# Altium schematic sheet P11_RS2-32_RS-485.SchDoc
size 420 x 297 mm
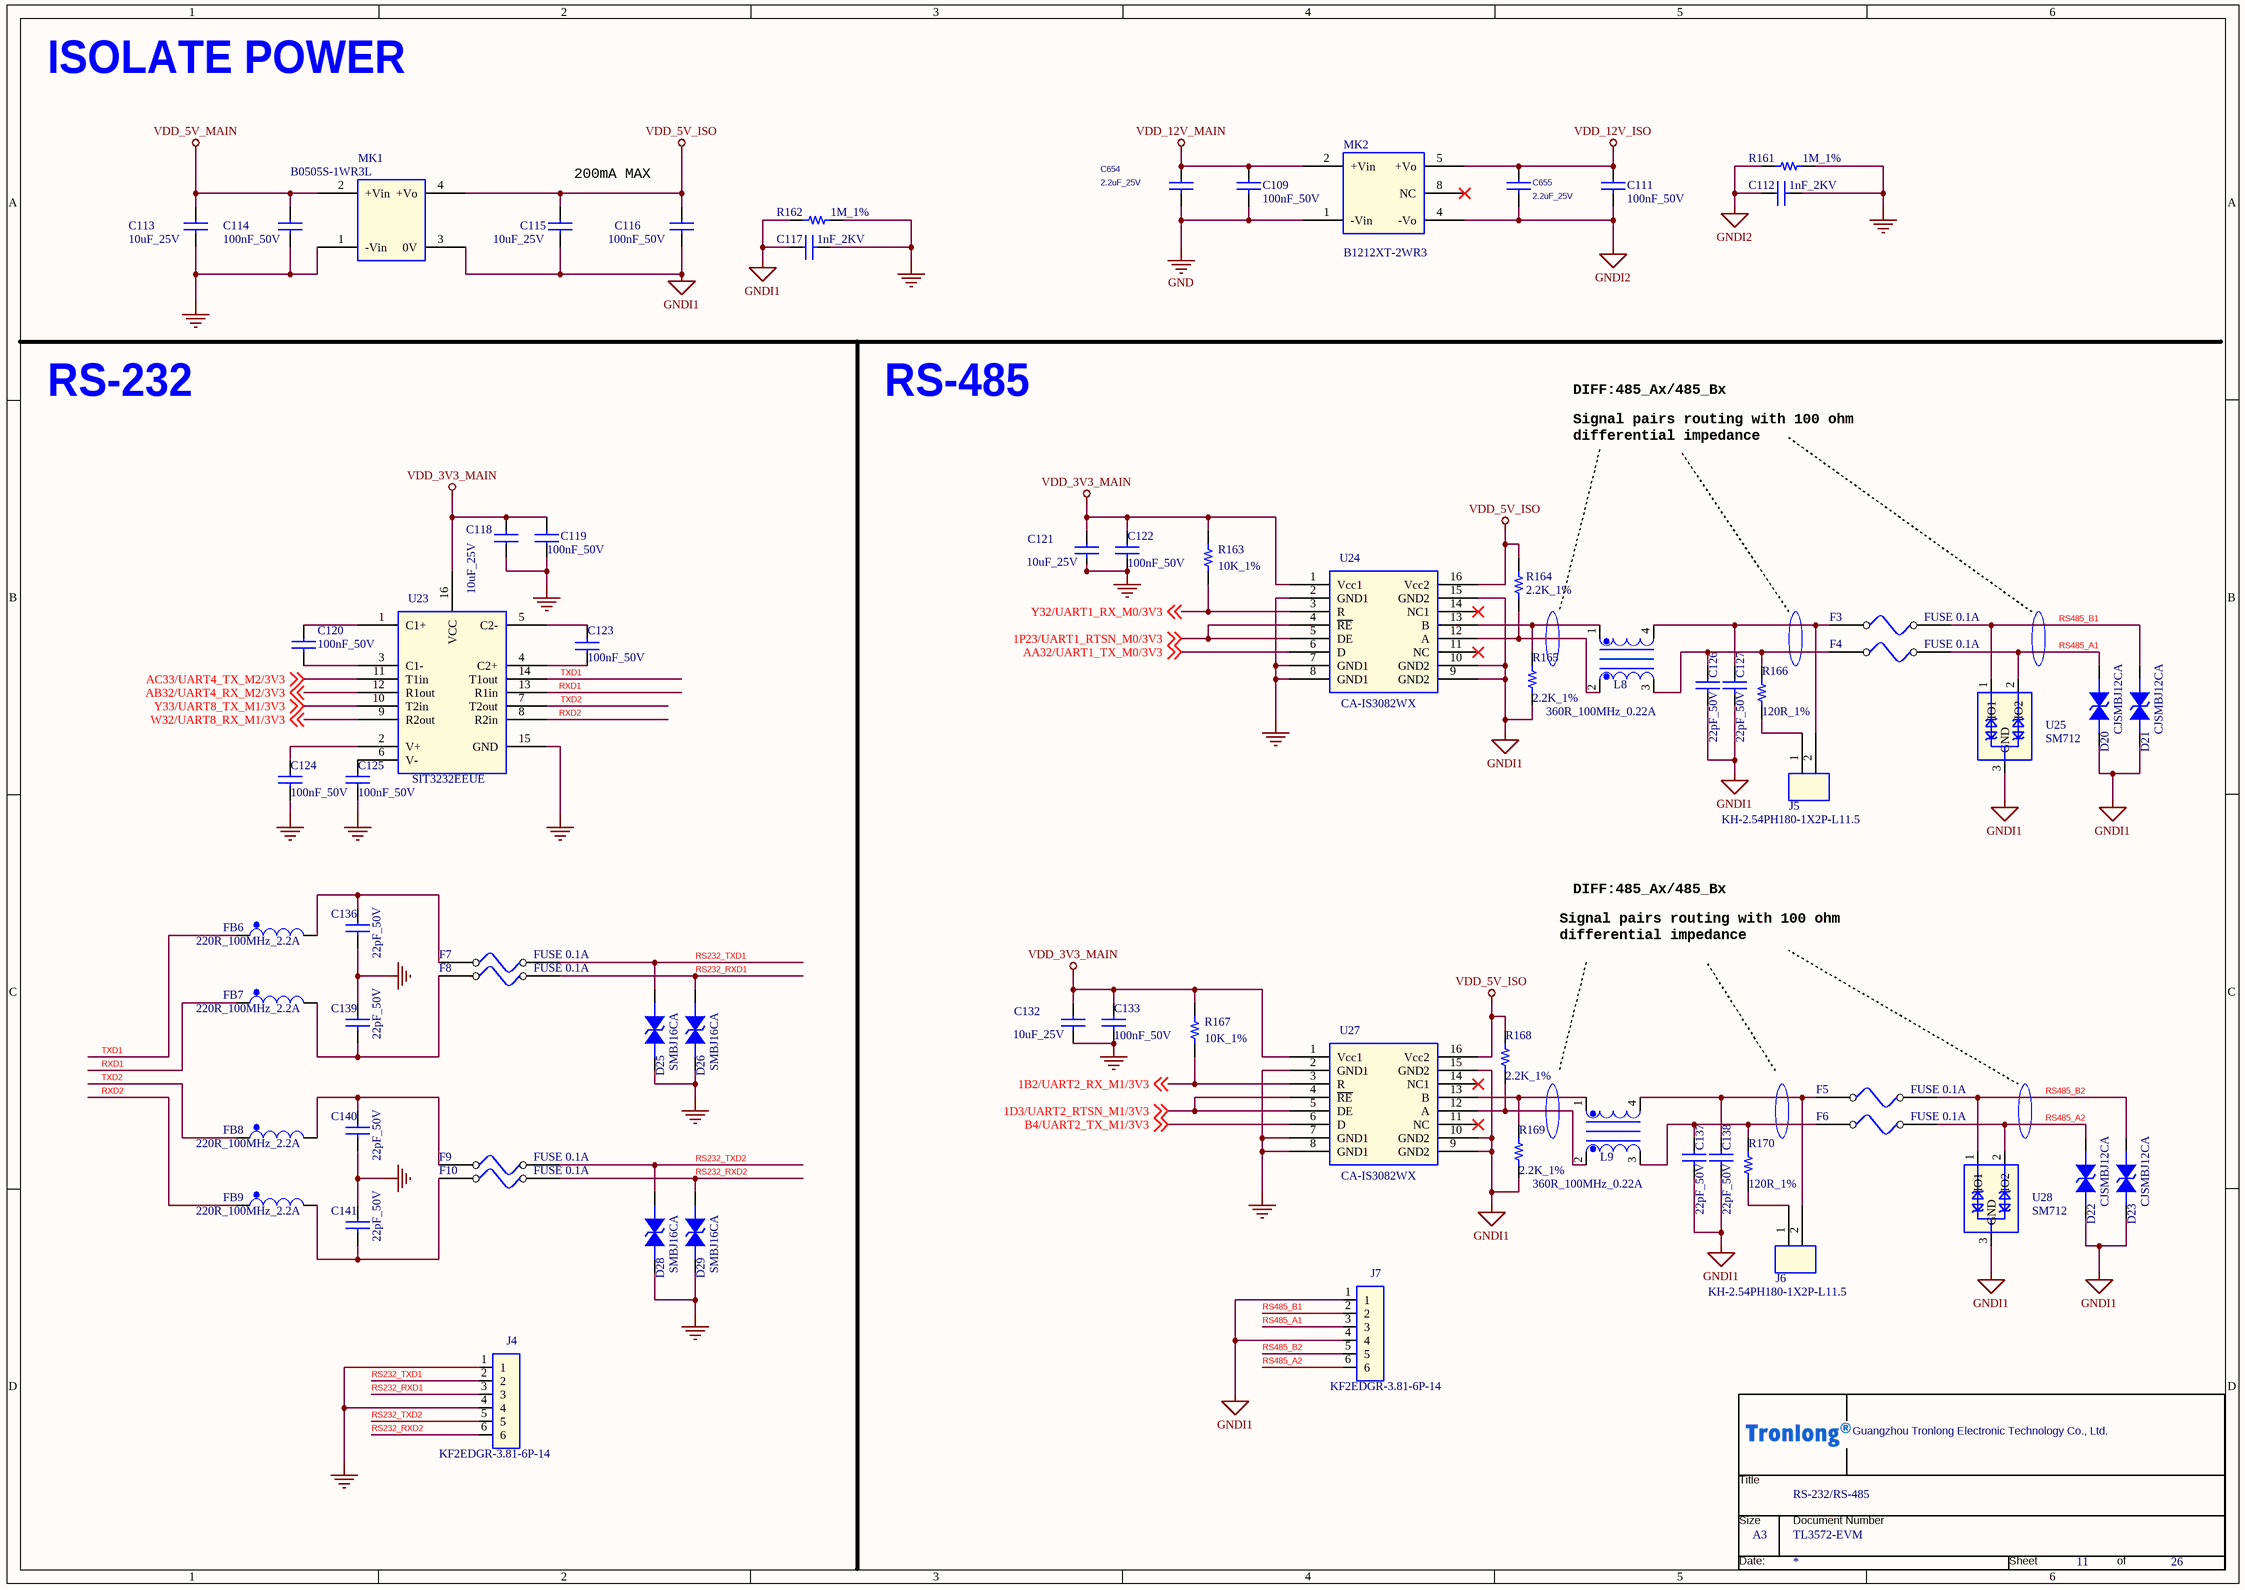
[diagram p0: P11_RS2-32_RS-485.SchDoc]

## Parts
*  Doc: TL3572-EVM  Title: RS-232/RS-485  OrgName: Guangzhou Tronlong Electronic Technology Co., Ltd.  Page Size: A3  Page Number: 11  Page Count: 26  (hidden comment: Tronlong_TITTLE_20211115)  (graphical)
C109  100nF_50V  [C0402]
C111  100nF_50V  [C0402]
C112  1nF_2KV  [C1206]
C113  10uF_25V  [C0603]
C114  100nF_50V  [C0402]
C115  10uF_25V  [C0603]
C116  100nF_50V  [C0402]
C117  1nF_2KV  [C1206]
C118  10uF_25V  [C0603]
C119  100nF_50V  [C0402]
C120  100nF_50V  [C0402]
C121  10uF_25V  [C0603]
C122  100nF_50V  [C0402]
C123  100nF_50V  [C0402]
C124  100nF_50V  [C0402]
C125  100nF_50V  [C0402]
C126  22pF_50V  [C0603]
C127  22pF_50V  [C0603]
C132  10uF_25V  [C0603]
C133  100nF_50V  [C0402]
C136  22pF_50V  [C0603]
C137  22pF_50V  [C0603]
C138  22pF_50V  [C0603]
C139  22pF_50V  [C0603]
C140  22pF_50V  [C0603]
C141  22pF_50V  [C0603]
C654  2.2uF_25V  [C1206]
C655  2.2uF_25V  [C1206]
D20  CJSMBJ12CA  [SMB]
D21  CJSMBJ12CA  [SMB]
D22  CJSMBJ12CA  [SMB]
D23  CJSMBJ12CA  [SMB]
D25  SMBJ16CA  [SMB]
D26  SMBJ16CA  [SMB]
D28  SMBJ16CA  [SMB]
D29  SMBJ16CA  [SMB]
F3  FUSE 0.1A  [F0805]
F4  FUSE 0.1A  [F0805]
F5  FUSE 0.1A  [F0805]
F6  FUSE 0.1A  [F0805]
F7  FUSE 0.1A  [F0805]
F8  FUSE 0.1A  [F0805]
F9  FUSE 0.1A  [F0805]
F10  FUSE 0.1A  [F0805]
FB6  220R_100MHz_2.2A  [L0603]
FB7  220R_100MHz_2.2A  [L0603]
FB8  220R_100MHz_2.2A  [L0603]
FB9  220R_100MHz_2.2A  [L0603]
J4  KF2EDGR-3.81-6P-14  [kf2eg_3_81-6p]
J5  KH-2.54PH180-1X2P-L11.5  [header_1x2p_2d54_male]
J6  KH-2.54PH180-1X2P-L11.5  [header_1x2p_2d54_male]
J7  KF2EDGR-3.81-6P-14  [kf2eg_3_81-6p]
L8  360R_100MHz_0.22A  [SMD-L2012M-4P]
L9  360R_100MHz_0.22A  [SMD-L2012M-4P]
MK1  B0505S-1WR3L  [PW_4P_2D54_L116W60_180_DIP]
MK2  B1212XT-2WR3  [PWRM_SMD_5P_L132W85_P254_LS114]
R161  1M_1%  [R1206]
R162  1M_1%  [R1206]
R163  10K_1%  [R0402]
R164  2.2K_1%  [R0603]
R165  2.2K_1%  [R0603]
R166  120R_1%  [R0805]
R167  10K_1%  [R0402]
R168  2.2K_1%  [R0603]
R169  2.2K_1%  [R0603]
R170  120R_1%  [R0805]
U23  SIT3232EEUE  [TSSOP16_PW16]
U24  CA-IS3082WX  [SO16W]
U25  SM712  [SOT23-3]
U27  CA-IS3082WX  [SO16W]
U28  SM712  [SOT23-3]

## Nets
GND: C109.2 C112.2 C113.2 C114.2 C117.2 C118.1 C119.1 C121.2 C122.2 C124.2 C125.2 C132.2 C133.2 C136.2 C139.1 C140.2 C141.1 C654.2 D25.1 D26.1 D28.1 D29.1 J4.1 J4.4 MK1.1(-Vin) MK2.1(-Vin) R161.2 R162.2 U23.15(GND) U24.2(GND1) U24.7(GND1) U24.8(GND1) U27.2(GND1) U27.7(GND1) U27.8(GND1)
GNDI1: C115.2 C116.2 C117.1 C126.2 C127.2 C137.2 C138.2 D20.1 D21.1 D22.1 D23.1 J7.1 J7.4 MK1.3(0V) R162.1 R165.2 R169.2 U24.9(GND2) U24.10(GND2) U24.15(GND2) U25.3(GND) U27.9(GND2) U27.10(GND2) U27.15(GND2) U28.3(GND)
GNDI2: C111.2 C112.1 C655.2 MK2.4(-Vo) R161.1
VDD_3V3_MAIN: C118.2 C119.2 C121.1 C122.1 C132.1 C133.1 R163.1 R167.1 U23.16(VCC) U24.1(Vcc1) U27.1(Vcc1)
VDD_5V_ISO: C115.1 C116.1 MK1.4(+Vo) R164.1 R168.1 U24.16(Vcc2) U27.16(Vcc2)
VDD_5V_MAIN: C113.1 C114.1 MK1.2(+Vin)
VDD_12V_ISO: C111.1 C655.1 MK2.5(+Vo)
VDD_12V_MAIN: C109.1 C654.1 MK2.2(+Vin)
1B2/UART2_RX_M1/3V3: R167.2 U27.3(R) ; off-sheet 1B2/UART2_RX_M1/3V3
1D3/UART2_RTSN_M1/3V3: U27.4(~{RE}) U27.5(DE) ; off-sheet 1D3/UART2_RTSN_M1/3V3
1P23/UART1_RTSN_M0/3V3: U24.4(~{RE}) U24.5(DE) ; off-sheet 1P23/UART1_RTSN_M0/3V3
AA32/UART1_TX_M0/3V3: U24.6(D) ; off-sheet AA32/UART1_TX_M0/3V3
AB32/UART4_RX_M2/3V3: U23.12(R1out) ; off-sheet AB32/UART4_RX_M2/3V3
AC33/UART4_TX_M2/3V3: U23.11(T1in) ; off-sheet AC33/UART4_TX_M2/3V3
B4/UART2_TX_M1/3V3: U27.6(D) ; off-sheet B4/UART2_TX_M1/3V3
RS232_RXD1: D26.2 F8.2 J4.3
RS232_RXD2: D29.2 F10.2 J4.6
RS232_TXD1: D25.2 F7.2 J4.2
RS232_TXD2: D28.2 F9.2 J4.5
RS485_A1: D20.2 F4.2 J7.3 U25.2(IO2)
RS485_A2: D22.2 F6.2 J7.6 U28.2(IO2)
RS485_B1: D21.2 F3.2 J7.2 U25.1(IO1)
RS485_B2: D23.2 F5.2 J7.5 U28.1(IO1)
RXD1: FB7.1 U23.13(R1in)
RXD2: FB9.1 U23.8(R2in)
TXD1: FB6.1 U23.14(T1out)
TXD2: FB8.1 U23.7(T2out)
W32/UART8_RX_M1/3V3: U23.9(R2out) ; off-sheet W32/UART8_RX_M1/3V3
Y32/UART1_RX_M0/3V3: R163.2 U24.3(R) ; off-sheet Y32/UART1_RX_M0/3V3
Y33/UART8_TX_M1/3V3: U23.10(T2in) ; off-sheet Y33/UART8_TX_M1/3V3
NetC120_1: C120.1 U23.1(C1+)
NetC120_2: C120.2 U23.3(C1-)
NetC123_1: C123.1 U23.4(C2+)
NetC123_2: C123.2 U23.5(C2-)
NetC124_1: C124.1 U23.2(V+)
NetC125_1: C125.1 U23.6(V-)
NetC126_1: C126.1 F4.1 L8.3 R166.2
NetC127_1: C127.1 F3.1 J5.2 L8.4
NetC136_1: C136.1 F7.1 FB6.2
NetC137_1: C137.1 F6.1 L9.3 R170.2
NetC138_1: C138.1 F5.1 J6.2 L9.4
NetC139_2: C139.2 F8.1 FB7.2
NetC140_1: C140.1 F9.1 FB8.2
NetC141_2: C141.2 F10.1 FB9.2
NetJ5_1: J5.1 R166.1
NetJ6_1: J6.1 R170.1
NetL8_1: L8.1 R165.1 U24.13(B)
NetL8_2: L8.2 R164.2 U24.12(A)
NetL9_1: L9.1 R169.1 U27.13(B)
NetL9_2: L9.2 R168.2 U27.12(A)

Not connected (* = marked no-connect by the designer): MK2 8(NC)*; U24 11(NC)* 14(NC1)*; U27 11(NC)* 14(NC1)*

## Notes on the sheet
- ISOLATE POWER
- 200mA MAX
- DIFF:485_Ax/485_Bx
- RS-232
- RS-485
- Signal pairs routing with 100 ohm
  differential impedance
- (in symbol Tronlong_TITTLE_20211115) Title; Size; Document Number; Date:; Sheet; of

## Library data of the parts
* = Tronlong_TITTLE_20211115: RevCode: A?; Page Create Date: March  8, 1995; Page Modify Date: *
C109 = CAP NP_Dup2: 贴片陶瓷电容,100nF,10%,50V,X7R; Manufacturer: 广东风华高新科技股份有限公司（FH）; Manufacturer PartNumber: 0402B104K500NT; Manufacturer Character: 中国大陆; ERP Number: 005.0001.0001.00681; As-Welded: /; room: 17; Operation Temperature（℃）: -55~+125(Ta); Eco-Label: ROHS; PCB Footprint: C0402; Part Status: 试用; Temperature: -55~125℃
C111 = CAP NP_Dup2: 贴片陶瓷电容,100nF,10%,50V,X7R; Manufacturer Character: 中国大陆; Manufacturer: 广东风华高新科技股份有限公司（FH）; Manufacturer PartNumber: 0402B104K500NT; Eco-Label: ROHS; Operation Temperature（℃）: -55~+125(Ta); room: 17; As-Welded: /; ERP Number: 005.0001.0001.00681; PCB Footprint: C0402; Temperature: -55~125℃; Part Status: 试用
C112 C117 = CAP NP_Dup2: 贴片陶瓷电容,1nF,10%,2KV,X7R; Manufacturer: 广东风华高新科技股份有限公司（FH）; Manufacturer PartNumber: 1206B102K202NT; Manufacturer Character: 中国大陆; ERP Number: 005.0001.0001.00730; As-Welded: /; Operation Temperature（℃）: -55~+125(Ta); Eco-Label: ROHS; Part Status: 试用; Temperature: –55~125℃; PCB Footprint: C1206
C113 = CAP NP_Dup3: 贴片陶瓷电容,10uF,20%,25V,X5R; Manufacturer Character: 中国大陆; Manufacturer PartNumber: 0603X106M250NT; Manufacturer: 广东风华高新科技股份有限公司（FH）; Eco-Label: ROHS; ERP Number: 005.0001.0001.00527; Operation Temperature（℃）: -55~+85(Ta); room: can-power; As-Welded: /; PCB Footprint: C0603; Part Status: 优选
C114 = CAP NP_Dup3: 贴片陶瓷电容,100nF,10%,50V,X7R; Manufacturer Character: 中国大陆; Manufacturer PartNumber: 0402B104K500NT; Manufacturer: 广东风华高新科技股份有限公司（FH）; Eco-Label: ROHS; ERP Number: 005.0001.0001.00681; Operation Temperature（℃）: -55~+125(Ta); room: can-power; As-Welded: /; PCB Footprint: C0402; Part Status: 试用
C115 = CAP NP_Dup3: 贴片陶瓷电容,10uF,20%,25V,X5R; Manufacturer PartNumber: 0603X106M250NT; Manufacturer Character: 中国大陆; Manufacturer: 广东风华高新科技股份有限公司（FH）; As-Welded: /; Operation Temperature（℃）: -55~+85(Ta); room: can-power; ERP Number: 005.0001.0001.00527; Eco-Label: ROHS; PCB Footprint: C0603; Part Status: 优选
C116 = CAP NP_Dup3: 贴片陶瓷电容,100nF,10%,50V,X7R; Manufacturer: 广东风华高新科技股份有限公司（FH）; Manufacturer PartNumber: 0402B104K500NT; Manufacturer Character: 中国大陆; As-Welded: /; Operation Temperature（℃）: -55~+125(Ta); room: can-power; ERP Number: 005.0001.0001.00681; Eco-Label: ROHS; PCB Footprint: C0402; Part Status: 试用
C118 = CAP NP_Dup2: 贴片陶瓷电容,10uF,20%,25V,X5R; Manufacturer Character: 中国大陆; Manufacturer: 广东风华高新科技股份有限公司（FH）; Manufacturer PartNumber: 0603X106M250NT; Eco-Label: ROHS; ERP Number: 005.0001.0001.00527; As-Welded: /; room: RS232; Operation Temperature（℃）: -55~+85(Ta); PCB Footprint: C0603; Temperature: -55~125℃; Part Status: 优选
C119 = CAP NP_Dup2: 贴片陶瓷电容,100nF,10%,50V,X7R; Manufacturer PartNumber: 0402B104K500NT; Manufacturer: 广东风华高新科技股份有限公司（FH）; Manufacturer Character: 中国大陆; Eco-Label: ROHS; ERP Number: 005.0001.0001.00681; As-Welded: /; Operation Temperature（℃）: -55~+125(Ta); room: RS232; PCB Footprint: C0402; Temperature: -55~125℃; Part Status: 试用
C120 = CAP NP_Dup2: 贴片陶瓷电容,100nF,10%,50V,X7R; Manufacturer Character: 中国大陆; Manufacturer PartNumber: 0402B104K500NT; Manufacturer: 广东风华高新科技股份有限公司（FH）; Eco-Label: ROHS; ERP Number: 005.0001.0001.00681; As-Welded: /; room: RS232; Operation Temperature（℃）: -55~+125(Ta); PCB Footprint: C0402; Temperature: -55~125℃; Part Status: 试用
C121 C132 = CAP NP_Dup2: 贴片陶瓷电容,10uF,20%,25V,X5R; Manufacturer Character: 中国大陆; Manufacturer: 广东风华高新科技股份有限公司（FH）; Manufacturer PartNumber: 0603X106M250NT; As-Welded: /; room: 6; Operation Temperature（℃）: -55~+85(Ta); ERP Number: 005.0001.0001.00527; Eco-Label: ROHS; PCB Footprint: C0603; Part Status: 优选; Temperature: -55~125℃
C122 = CAP NP_Dup2: 贴片陶瓷电容,100nF,10%,50V,X7R; Manufacturer: 广东风华高新科技股份有限公司（FH）; Manufacturer PartNumber: 0402B104K500NT; Manufacturer Character: 中国大陆; Eco-Label: ROHS; ERP Number: 005.0001.0001.00681; As-Welded: /; Operation Temperature（℃）: -55~+125(Ta); room: 6; PCB Footprint: C0402; Temperature: -55~125℃; Part Status: 试用
C123 = CAP NP_Dup2: 贴片陶瓷电容,100nF,10%,50V,X7R; Manufacturer: 广东风华高新科技股份有限公司（FH）; Manufacturer PartNumber: 0402B104K500NT; Manufacturer Character: 中国大陆; Eco-Label: ROHS; ERP Number: 005.0001.0001.00681; Operation Temperature（℃）: -55~+125(Ta); room: RS232; As-Welded: /; PCB Footprint: C0402; Temperature: -55~125℃; Part Status: 试用
C124 = CAP NP_Dup2: 贴片陶瓷电容,100nF,10%,50V,X7R; Manufacturer Character: 中国大陆; Manufacturer: 广东风华高新科技股份有限公司（FH）; Manufacturer PartNumber: 0402B104K500NT; Eco-Label: ROHS; ERP Number: 005.0001.0001.00681; As-Welded: /; room: RS232; Operation Temperature（℃）: -55~+125(Ta); PCB Footprint: C0402; Temperature: -55~125℃; Part Status: 试用
C125 = CAP NP_Dup2: 贴片陶瓷电容,100nF,10%,50V,X7R; Manufacturer PartNumber: 0402B104K500NT; Manufacturer: 广东风华高新科技股份有限公司（FH）; Manufacturer Character: 中国大陆; Eco-Label: ROHS; ERP Number: 005.0001.0001.00681; Operation Temperature（℃）: -55~+125(Ta); room: RS232; As-Welded: /; PCB Footprint: C0402; Temperature: -55~125℃; Part Status: 试用
C126 C137 = CAP NP_Dup2: 贴片陶瓷电容,22pF,5%,50V,COG; Manufacturer Character: 中国大陆; Manufacturer: 广东风华高新科技股份有限公司（FH）; Manufacturer PartNumber: 0603CG220J500NT; As-Welded: /; Operation Temperature（℃）: -55~+125(Ta); ERP Number: 005.0001.0001.00542; Eco-Label: EXEMPTION; PCB Footprint: C0603; Part Status: 优选; Temperature: -55~125℃
C127 C138 = CAP NP_Dup2: 贴片陶瓷电容,22pF,5%,50V,COG; Manufacturer Character: 中国大陆; Manufacturer PartNumber: 0603CG220J500NT; Manufacturer: 广东风华高新科技股份有限公司（FH）; Eco-Label: EXEMPTION; ERP Number: 005.0001.0001.00542; Operation Temperature（℃）: -55~+125(Ta); As-Welded: /; PCB Footprint: C0603; Temperature: -55~125℃; Part Status: 优选
C133 = CAP NP_Dup2: 贴片陶瓷电容,100nF,10%,50V,X7R; Manufacturer Character: 中国大陆; Manufacturer PartNumber: 0402B104K500NT; Manufacturer: 广东风华高新科技股份有限公司（FH）; room: 6; Operation Temperature（℃）: -55~+125(Ta); As-Welded: /; ERP Number: 005.0001.0001.00681; Eco-Label: ROHS; PCB Footprint: C0402; Part Status: 试用; Temperature: -55~125℃
C136 C140 = CAP NP_Dup2: 贴片陶瓷电容,22pF,5%,50V,C0G; Manufacturer Character: 中国大陆; Manufacturer PartNumber: 0603CG220J500NT; Manufacturer: 广东风华高新科技股份有限公司（FH）; Eco-Label: EXEMPTION; ERP Number: 005.0001.0001.00542; As-Welded: /; room: 6; Operation Temperature（℃）: -55~+125(Ta); PCB Footprint: C0603; Temperature: -55~125℃; Part Status: 优选
C139 C141 = CAP NP_Dup2: 贴片陶瓷电容,22pF,5%,50V,C0G; Manufacturer Character: 中国大陆; Manufacturer: 广东风华高新科技股份有限公司（FH）; Manufacturer PartNumber: 0603CG220J500NT; Eco-Label: EXEMPTION; ERP Number: 005.0001.0001.00542; As-Welded: /; room: 6; Operation Temperature（℃）: -55~+125(Ta); PCB Footprint: C0603; Temperature: -55~125℃; Part Status: 优选
C654 C655 = CAP NP_Dup2: 贴片陶瓷电容,2.2uF,10%,25V,X7R; Manufacturer Character: 中国大陆; Manufacturer PartNumber: 1206B225K250NT; Manufacturer: 广东风华高新科技股份有限公司（FH）; As-Welded: /; Operation Temperature（℃）: -55~+125(Ta); ERP Number: 005.0001.0001.00646; Eco-Label: ROHS; PCB Footprint: C1206; Part Status: 试用
D20-D23 = DIODE-TRIG: TVS二极管,VRWM=12V,VBR=13.35V,一组,双向; Manufacturer: 江苏长晶科技股份有限公司（JSCJ）; Manufacturer Character: 中国大陆; Eco-Label: ROHS; ERP Number: 005.0001.0017.00082; room: DCIN; Operation Temperature（℃）: -55~+150(Tj); As-Welded: /; PCB Footprint: SMB; Manufacturer PartNumber: CJSMBJ12CA; Temperature: -55~150℃; Part Status: 试用
D25 D29 = DIODE-TRIG: TVS二极管,VRWM=16V,VBR=17.8V,一组,双向; Manufacturer: 江苏长晶科技有限公司（JSCJ）; Manufacturer Character: 中国大陆; Eco-Label: ROHS; ERP Number: 005.0001.0017.00077; room: DCIN; Operation Temperature（℃）: -55~+150(Tj); As-Welded: /; PCB Footprint: SMB; Part Status: 试用; Manufacturer PartNumber: SMBJ16CA; Temperature: -55~150℃
D26 = DIODE-TRIG: TVS二极管,VRWM=16V,VBR=17.8V,一组,双向; Manufacturer Character: 无限制; Manufacturer: 江苏长晶科技有限公司（JSCJ）; As-Welded: /; Operation Temperature（℃）: -55~150℃; room: DCIN; PCB Footprint: SMB; Temperature: -55~150℃; Manufacturer PartNumber: SMBJ16CA
D28 = DIODE-TRIG: TVS二极管,VRWM=16V,VBR=17.8V,一组,双向; Manufacturer: 江苏长晶科技有限公司（JSCJ）; Manufacturer Character: 无限制; room: DCIN; Operation Temperature（℃）: -55~150℃; As-Welded: /; PCB Footprint: SMB; Manufacturer PartNumber: SMBJ16CA; Temperature: -55~150℃
F3 F5 F7-F10 = FUSE: 自恢复保险丝,Vmax=24V,Imax=100A,Ihold=0.1A; Manufacturer Character: 中国大陆; Manufacturer: 东莞市竞沃电子科技有限公司（TLC）; Manufacturer PartNumber: TLC-PSMD010/24; As-Welded: /; Operation Temperature（℃）: -40~+85(Ta); ERP Number: 005.0001.0011.00038; Eco-Label: ROHS; PCB Footprint: F0805; Part Status: 测评; Temperature: -55~125℃
F4 F6 = FUSE: 自恢复保险丝,Vmax=24V,Imax=100A,Ihold=0.1A; Manufacturer PartNumber: TLC-PSMD010/24; Manufacturer: 东莞市竞沃电子科技有限公司（TLC）; Manufacturer Character: 中国大陆; Operation Temperature（℃）: -40~+85(Ta); As-Welded: /; ERP Number: 005.0001.0011.00038; Eco-Label: ROHS; PCB Footprint: F0805; Part Status: 测评; Temperature: -55~125℃
FB6 FB9 = FB_0: 磁珠,50mΩ,2.2A,220R@100MHz; Manufacturer: 深圳顺络电子股份有限公司（Sunlord）; Manufacturer PartNumber: UPZ1608U221-2R2TF; Manufacturer Character: 中国大陆; As-Welded: /; ERP Number: 005.0001.0007.00015; Eco-Label: ROHS; Operation Temperature（℃）: -55~+125(Ta); PCB Footprint: L0603; Part Status: 限选; Temperature: -55~125℃
FB7 FB8 = FB_0: 磁珠,50mΩ,2.2A,220R@100MHz; Manufacturer Character: 中国大陆; Manufacturer PartNumber: UPZ1608U221-2R2TF; Manufacturer: 深圳顺络电子股份有限公司（Sunlord）; Operation Temperature（℃）: -55~+125(Ta); Eco-Label: ROHS; ERP Number: 005.0001.0007.00015; As-Welded: /; PCB Footprint: L0603; Part Status: 限选; Temperature: -55~125℃
J4 J7 = CON6: 插拔式端子座,1x6P,3.81mm,90度; Manufacturer: 慈溪市科发电子有限公司（KEFA）; Manufacturer Character: 中国大陆; Eco-Label: ROHS; ERP Number: 005.0001.0003.00419; As-Welded: /; Operation Temperature（℃）: -40~+105(Ta); PCB Footprint: kf2eg_3_81-6p; Part Status: 优选; Manufacturer PartNumber: KF2EDGR-3.81-6P-14
J5 J6 = CON2_0: 插件单排排针,1x2P,2.54mm,180度; Manufacturer: 深圳市金航标电子有限公司(kinghelm); Manufacturer Character: 中国大陆; As-Welded: /; Operation Temperature（℃）: -40~+105(Ta); ERP Number: 005.0001.0003.00566; Eco-Label: ROHS; PCB Footprint: header_1x2p_2d54_male; Temperature: -40~105℃; Manufacturer PartNumber: KH-2.54PH180-1X2P-L11.5; Part Status: 优选
L8 = TFR_AXA_A_1: 贴片共模电感,500mΩ,0.22A,50V,360Ω@100MHz; Manufacturer PartNumber: ACM2012-361-2P-T001; Manufacturer: TDK(日本东电化); Manufacturer Character: 国外; Eco-Label: ROHS; As-Welded: /; Operation Temperature（℃）: -40~+105(Ta); ERP Number: 005.0001.0006.00103; PCB Footprint: SMD-L2012M-4P; Part Status: 测评
L9 = TFR_AXA_A_1: 贴片共模电感,500mΩ,0.22A,50V,360Ω@100MHz; Manufacturer Character: 国外; Manufacturer: TDK(日本东电化); Manufacturer PartNumber: ACM2012-361-2P-T001; ERP Number: 005.0001.0006.00103; Operation Temperature（℃）: -40~+105(Ta); As-Welded: /; Eco-Label: ROHS; PCB Footprint: SMD-L2012M-4P; Part Status: 测评
MK1 = B_S-2W_1: DC-DC隔离电源,Vi=5V,Vo=5V,Io=200mA,3KV,η=77%,插件; Manufacturer: 广州金升阳科技有限公司（MORNSUN）; Manufacturer Character: 中国大陆; As-Welded: /; room: RS485; Operation Temperature（℃）: -40~+105(Ta); ERP Number: 005.0001.0012.00022; Eco-Label: ROHS; PCB Footprint: PW_4P_2D54_L116W60_180_DIP; Part Status: 优选; Manufacturer PartNumber: B0505S-1WR3L; Temperature: -40~85℃
MK2 = B_S-2W_2: DC-DC隔离电源,Vi=12V,Vo=12V,Io=167mA,1.5KV,η=80%,贴片; Manufacturer Character: 中国大陆; Manufacturer: 广州金升阳科技有限公司（MORNSUN）; Operation Temperature（℃）: -40~+105(Ta); As-Welded: /; ERP Number: 005.0001.0012.00054; Eco-Label: ROHS; PCB Footprint: PWRM_SMD_5P_L132W85_P254_LS114; Part Status: 试用; Temperature: -40~85℃; Manufacturer PartNumber: B1212XT-2WR3
R161 R162 = Resistor: 贴片电阻,1M,±1%,1/4W; Manufacturer: 广东风华高新科技股份有限公司（FH）; Manufacturer PartNumber: RS-06K1004FT; Manufacturer Character: 中国大陆; CLASS: DISCRETE; Eco-Label: ROHS; Operation Temperature（℃）: -55~+155(Ta); room: USB HUB; As-Welded: /; ERP Number: 005.0001.0002.01458; PCB Footprint: R1206; Part Status: 测评
R163 R167 = Resistor_Dup3: 贴片电阻,10K,±1%,1/16W; Manufacturer Character: 中国大陆; Manufacturer: 广东风华高新科技股份有限公司（FH）; Manufacturer PartNumber: RC-02K1002FT; CLASS: DISCRETE; As-Welded: /; room: 6; Operation Temperature（℃）: -55~+125(Ta); ERP Number: 005.0001.0002.01326; Eco-Label: ROHS; PCB Footprint: R0402; Part Status: 优选; Temperature: –55~155℃
R164 R168 = Resistor_Dup3: 贴片电阻,2.2K,±1%,1/10W; Manufacturer PartNumber: RS-03K2201FT; Manufacturer: 广东风华高新科技股份有限公司（FH）; Manufacturer Character: 中国大陆; CLASS: DISCRETE; Eco-Label: ROHS; room: 6; Operation Temperature（℃）: -55~+155(Ta); As-Welded: /; ERP Number: 005.0001.0002.00972; PCB Footprint: R0603; Part Status: 优选
R165 = Resistor_Dup3: 贴片电阻,2.2K,±1%,1/10W; Manufacturer Character: 中国大陆; Manufacturer: 广东风华高新科技股份有限公司（FH）; Manufacturer PartNumber: RS-03K2201FT; CLASS: DISCRETE; ERP Number: 005.0001.0002.00972; As-Welded: /; Operation Temperature（℃）: -55~+155(Ta); room: 6; Eco-Label: ROHS; PCB Footprint: R0603; Part Status: 优选
R166 R170 = Resistor_Dup3: 贴片电阻,120R,±1%,1/8W; Manufacturer: 广东风华高新科技股份有限公司（FH）; Manufacturer PartNumber: RS-05K1200FT; Manufacturer Character: 中国大陆; CLASS: DISCRETE; As-Welded: /; Operation Temperature（℃）: -55~+155(Ta); ERP Number: 005.0001.0002.01050; Eco-Label: ROHS; PCB Footprint: R0805; Part Status: 优选; Temperature: -55~125℃
R169 = Resistor_Dup3: 贴片电阻,2.2K,±1%,1/10W; Manufacturer PartNumber: RS-03K2201FT; Manufacturer: 广东风华高新科技股份有限公司（FH）; Manufacturer Character: 中国大陆; CLASS: DISCRETE; ERP Number: 005.0001.0002.00972; room: 6; Operation Temperature（℃）: -55~+155(Ta); As-Welded: /; Eco-Label: ROHS; PCB Footprint: R0603; Part Status: 优选
U23 = MAX232A_0: RS232收发器; Manufacturer: 湖南芯力特电子科技有限公司（SIT）; Manufacturer Character: 中国大陆; Eco-Label: ROHS; ERP Number: 005.0001.0004.00886; As-Welded: /; Operation Temperature（℃）: -40~+85(Ta); room: RS232; PCB Footprint: TSSOP16_PW16; Manufacturer PartNumber: SIT3232EEUE; Temperature: -40~85℃; Part Status: 优选
U24 = ISO3082_4: RS485收发器,2.5V~5.5V; Manufacturer: 上海川土微电子有限公司（CHIPANALOG）; Manufacturer Character: 中国大陆; Eco-Label: ROHS; ERP Number: 005.0003.0007.00078; Operation Temperature（℃）: -40~+125(Ta); room: 6; As-Welded: /; PCB Footprint: SO16W; Temperature: -40~125℃; Manufacturer PartNumber: CA-IS3082WX; Part Status: 试用
U25 U28 = PSM712: TVS二极管,VRWM=7V/12V,VBR=7.5V/13.3V,两组,双向,30KV,30KV; Manufacturer: 上海雷卯电子科技有限公司（Leiditech）; Manufacturer Character: 中国大陆; Eco-Label: ROHS; ERP Number: 005.0001.0017.00079; Operation Temperature（℃）: -55~+125(Ta); As-Welded: /; PCB Footprint: SOT23-3; Part Status: 试用; Manufacturer PartNumber: SM712
U27 = ISO3082_5: RS485收发器,2.5V~5.5V; Manufacturer Character: 中国大陆; Manufacturer: 上海川土微电子有限公司（CHIPANALOG）; As-Welded: /; room: 6; Operation Temperature（℃）: -40~+125(Ta); ERP Number: 005.0003.0007.00078; Eco-Label: ROHS; PCB Footprint: SO16W; Part Status: 试用; Manufacturer PartNumber: CA-IS3082WX; Temperature: -40~125℃